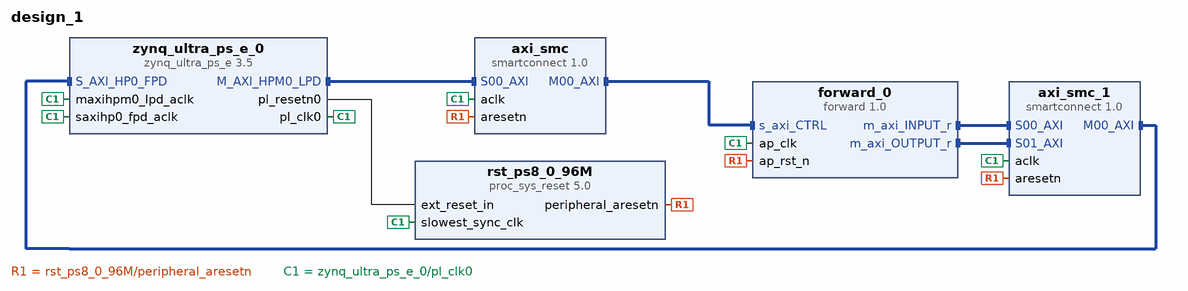
[diagram p0: block diagram of the top level]
# Vivado block design design_1, xczu3eg-sbva484-2-i, Vivado 2025.1
create_bd_design design_1

create_bd_cell -type ip -vlnv xilinx.com:ip:zynq_ultra_ps_e:3.5 zynq_ultra_ps_e_0
set_property -dict {CONFIG.PSU__DDR_HIGH_ADDRESS_GUI_ENABLE 0 CONFIG.PSU__USE__S_AXI_GP2 1} [get_bd_cells zynq_ultra_ps_e_0]
# 5 more settings of zynq_ultra_ps_e_0 are not shown: defaults, MIO pin electricals, DDR timing, and values the tool derives
create_bd_cell -type ip -vlnv xilinx.com:hls:forward:1.0 forward_0
create_bd_cell -type ip -vlnv xilinx.com:ip:smartconnect:1.0 axi_smc
set_property -dict {CONFIG.NUM_SI 1} [get_bd_cells axi_smc]
create_bd_cell -type ip -vlnv xilinx.com:ip:proc_sys_reset:5.0 rst_ps8_0_96M
create_bd_cell -type ip -vlnv xilinx.com:ip:smartconnect:1.0 axi_smc_1
set_property -dict {CONFIG.NUM_SI 2} [get_bd_cells axi_smc_1]

# ---- connections ----

connect_bd_intf_net [get_bd_intf_pins axi_smc_1/M00_AXI] [get_bd_intf_pins zynq_ultra_ps_e_0/S_AXI_HP0_FPD]
connect_bd_intf_net [get_bd_intf_pins axi_smc/M00_AXI] [get_bd_intf_pins forward_0/s_axi_CTRL]
connect_bd_intf_net [get_bd_intf_pins forward_0/m_axi_INPUT_r] [get_bd_intf_pins axi_smc_1/S00_AXI]
connect_bd_intf_net [get_bd_intf_pins forward_0/m_axi_OUTPUT_r] [get_bd_intf_pins axi_smc_1/S01_AXI]
connect_bd_intf_net [get_bd_intf_pins zynq_ultra_ps_e_0/M_AXI_HPM0_LPD] [get_bd_intf_pins axi_smc/S00_AXI]
connect_bd_net [get_bd_pins rst_ps8_0_96M/peripheral_aresetn] \
  [get_bd_pins forward_0/ap_rst_n] [get_bd_pins axi_smc/aresetn] [get_bd_pins axi_smc_1/aresetn]
connect_bd_net [get_bd_pins zynq_ultra_ps_e_0/pl_clk0] \
  [get_bd_pins zynq_ultra_ps_e_0/maxihpm0_lpd_aclk] [get_bd_pins zynq_ultra_ps_e_0/saxihp0_fpd_aclk] \
  [get_bd_pins axi_smc/aclk] [get_bd_pins forward_0/ap_clk] [get_bd_pins rst_ps8_0_96M/slowest_sync_clk] \
  [get_bd_pins axi_smc_1/aclk]
connect_bd_net [get_bd_pins zynq_ultra_ps_e_0/pl_resetn0] [get_bd_pins rst_ps8_0_96M/ext_reset_in]

# ---- address map ----
assign_bd_address -offset 0x0000000000000000 -range 2G -target_address_space [get_bd_addr_spaces forward_0/Data_m_axi_INPUT_r] [get_bd_addr_segs zynq_ultra_ps_e_0/SAXIGP2/HP0_DDR_LOW]
exclude_bd_addr_seg -offset 0x00000000FF000000 -range 16M -target_address_space [get_bd_addr_spaces forward_0/Data_m_axi_INPUT_r] [get_bd_addr_segs zynq_ultra_ps_e_0/SAXIGP2/HP0_LPS_OCM]
assign_bd_address -offset 0x0000000000000000 -range 2G -target_address_space [get_bd_addr_spaces forward_0/Data_m_axi_OUTPUT_r] [get_bd_addr_segs zynq_ultra_ps_e_0/SAXIGP2/HP0_DDR_LOW]
exclude_bd_addr_seg -offset 0x00000000FF000000 -range 16M -target_address_space [get_bd_addr_spaces forward_0/Data_m_axi_OUTPUT_r] [get_bd_addr_segs zynq_ultra_ps_e_0/SAXIGP2/HP0_LPS_OCM]
assign_bd_address -offset 0x0080000000 -range 64K -target_address_space [get_bd_addr_spaces zynq_ultra_ps_e_0/Data] [get_bd_addr_segs forward_0/s_axi_CTRL/Reg]

validate_bd_design
save_bd_design
